# EasyEDA Pro project uven2-mk3-cc-driver-25x.eprj, board AL8843-cc-driver
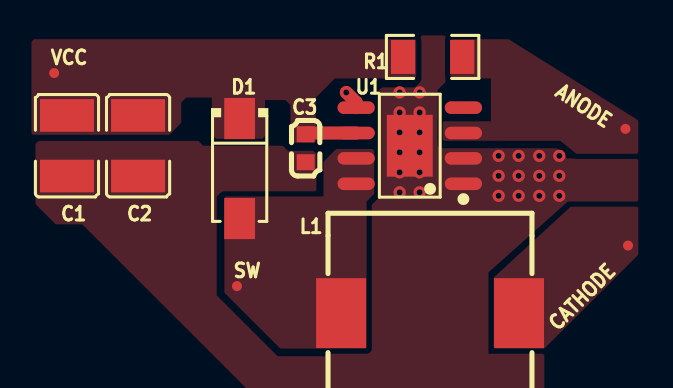
[diagram p4: board, top side]
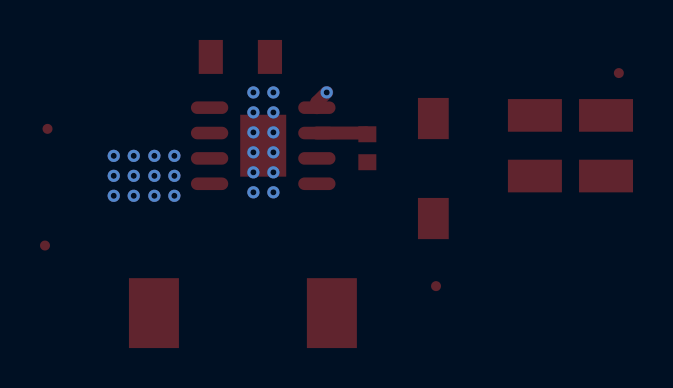
[diagram p5: board, bottom side, seen from below]

No outline. copper layers: Top Layer, Bottom Layer. Coordinates in mm from the lowest, leftmost part position.
Stack: Top Layer 0.035mm / Dielectric1 1.51mm FR4 er 4.5 / Bottom Layer 0.035mm

## Design rules (mm)
template: Custom Config
spacing copperThickness1oz (default): track to track 0.102, other pairs 0.152 to 0.3
spacing copperThickness2oz: track to track 0.203, other pairs 0.152 to 0.3
track width copperThickness1oz (default): min 0.127, default 0.254, max 2.54
track width copperThickness2oz: min 0.203, default 0.254, max 2.54
differential pair differentialPair (default): width min 0.127, default 0.254, max 2.54; gap min 0.152, default 0.152
via viaSize (default): diameter min 0.5, default 0.61, max 10; hole min 0.3, default 0.305, max 6.3

## Placement (name value [footprint] x y rotation side)
ANODE  -  [Test-Point-0.5mm]  28.57 9.23 0 top
C1  4.7uF  [C1210]  0.64 8.38 90 top
C2  4.7uF  [C1210]  4.2 8.38 90 top
C3  100nF  [C0603]  12.58 8.26 90 top
CATHODE  -  [Test-Point-0.5mm]  28.7 3.38 0 top
D1  SS54  [SMA_L4.4-W2.8-LS5.4-R-RD]  9.28 7.24 270 top
L1  4.7uH  [IND-SMD_L10.2-W10.0_MS104R]  18.8 0 0 top
R1  50mΩ  [R1206]  18.93 12.83 0 top
SW  -  [Test-Point-0.5mm]  9.14 1.35 0 top
U1  AL8843QSP-13  [SOIC-8_L4.9-W3.9-P1.27-LS6.0-BL-EP3.1-1]  17.79 8.38 90 top
VCC  -  [Test-Point-0.5mm]  0 12.02 0 top

## Footprints (pads in the part's own frame, mm; a bottom-side part is the same pattern mirrored in y, then rotated)
C0603
  rect 0.8x0.9 smd: 1(-0.7,0) 2(0.7,0)
C1210
  rect 1.635x2.7 smd: 1(-1.518,0) 2(1.518,0)
IND-SMD_L10.2-W10.0_MS104R
  rect 2.5x3.5 smd: 1(-4.45,0) 2(4.45,0)
R1206
  rect 1.208x1.701 smd: 1(-1.479,0) 2(1.479,0)
SMA_L4.4-W2.8-LS5.4-R-RD
  rect 2.062x1.539 smd: 1(2.503,0) 2(-2.503,0)
SOIC-8_L4.9-W3.9-P1.27-LS6.0-BL-EP3.1-1
  oval 0.63x1.865 smd: 1(-1.905,-2.683) 2(-0.635,-2.683) 3(0.635,-2.683) 4(1.905,-2.683) 5(1.905,2.683) 6(0.635,2.683) 7(-0.635,2.683) 8(-1.905,2.683)
  rect 3.1x2.3 smd: 9(0,0)
Test-Point-0.5mm
  round 0.5 smd: 1(0,0)

## Nets
As in the schematic.

Pads without a net: U1 4

## Via types
v1: diameter 0.61, hole 0.305, Top Layer to Bottom Layer, 25 vias

## Routing (per net, layer and track width the routed paths; a pad name or vN(x,y) marks a point on that pad's centre or on a via; arc(x,y) is an arc through that point)
GND:
  vias: v1(17.28,11.05) v1(17.28,10.05) v1(17.28,9.05) v1(17.28,8.05) v1(17.28,7.05) v1(17.28,6.05) v1(18.28,11.05) v1(18.28,10.05) v1(18.28,9.05) v1(18.28,8.05) v1(18.28,7.05) v1(18.28,6.05) v1(22.23,7.87) v1(22.23,6.87) v1(22.23,5.87) v1(23.23,7.87) v1(23.23,6.87) v1(23.23,5.87) v1(24.26,7.87) v1(24.26,6.87) v1(24.26,5.87) v1(25.26,7.87) v1(25.26,6.87) v1(25.26,5.87)
VCC: length 2.6
  Top Layer w0.65: C3.2 12.64,9.02 U1.6
CTRL: length 1
  Top Layer w0.65: U1.5 15.1,10.56 v1(14.61,11.05)

## Copper pours and planes (outline as drawn; the poured copper is in the pictures)
GND on Top Layer: 25.69,5.59 21.72,2.04 21.72,-2.03 24.52,-2.03 24.52,-5.08 24.39,-5.21 11.06,-5.21 1.4,4.45 0.07,4.45 -0.94,5.46 -0.94,8.47 -0.78,8.62 7.21,8.62 7.45,8.38 11.44,8.38 11.69,8.13 12.97,8.13 13.12,7.98 13.12,6 13.09,5.97 8.26,5.97 8.13,5.84 8.13,0.89 11.18,-2.16 13.45,-2.16 13.49,-2.19 13.7,-1.98 15.68,-1.98 15.75,-1.91 15.75,5.3 16.26,5.81 16.26,11.18 16.39,11.3 18.04,11.3 18.29,11.56 18.29,13.84 18.36,13.91 19.64,13.91 19.64,11.64 19.18,11.18 19.18,8.38 19.31,8.26 25.15,8.26 25.66,7.75 29.22,7.75 29.22,5.59
VCC on Top Layer: 18.04,13.72 -1.01,13.72 -1.14,13.59 -1.14,8.93 5.76,8.93 6.36,9.53 6.36,10.54 6.61,10.8 7.88,10.8 7.88,8.95 8.1,8.73 10.42,8.73 10.55,8.86 10.55,10.67 11.56,10.67 11.82,10.41 11.82,8.54 13.06,8.54 13.09,8.51 13.09,10.8 14.04,11.75 18.11,11.75 18.11,13.65
ANODE on Top Layer: 29.22,7.98 29.22,9.65 22.73,13.72 19.82,13.72 19.82,11.75 21.84,11.75 21.84,9.61 19.43,9.61 19.43,8.63 25.31,8.63 26.12,7.98
CATHODE on Top Layer: 21.98,-1.78 21.98,1.78 25.84,5.33 29.22,5.33 29.22,2.92 24.52,-1.78
$1N360 on Top Layer: 14.11,8.22 15.91,8.22 16.01,8.13 16.01,5.97 15.63,5.59 15.63,-1.78 11.31,-1.78 8.52,1.02 8.52,5.84 13.47,5.84 13.47,7.58
